# EAGLE design sa818shield (EAGLE 7.4.0)
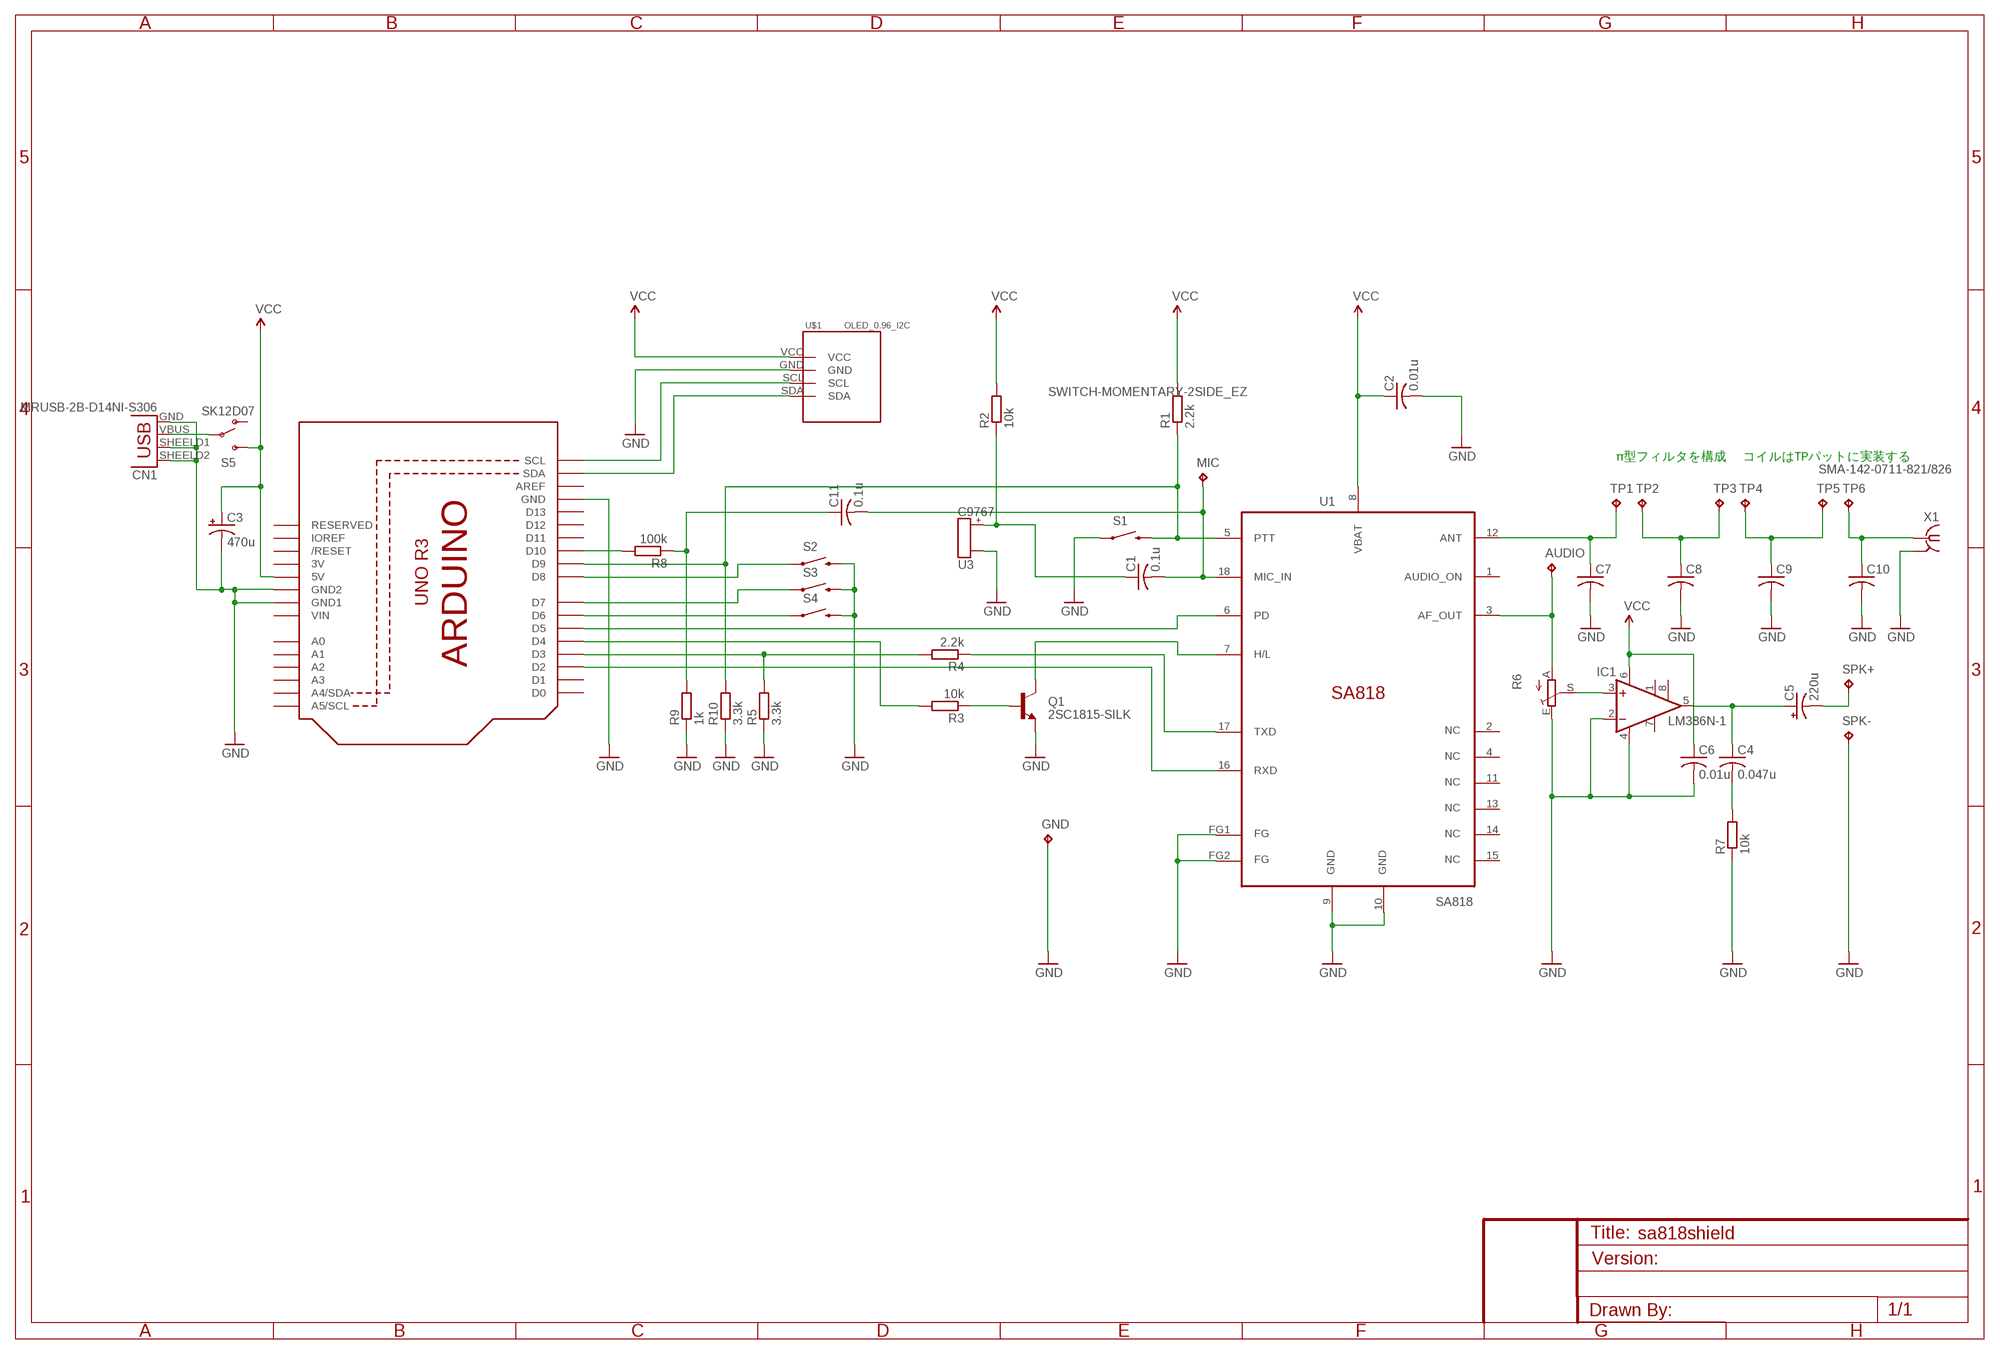
[diagram p0: schematic, sheet 1]

## Parts
AUDIO  TPPAD1-13  [P1-13]
C1  0.1u  C-US025-024X044  [C025-024X044]
C2  0.01u  C-US025-024X044  [C025-024X044]
C3  470u  CPOL-USE5-10.5  [E5-10,5]
C4  0.047u  C-US025-024X044  [C025-024X044]
C5  220u  CAP_POLPTH2  [CPOL-RADIAL-10UF-25V]
C6  0.01u  C-US025-024X044  [C025-024X044]
C7  C-USC0805K  [C0805K]
C8  C-USC0805K  [C0805K]
C9  C-USC0805K  [C0805K]
C10  C-USC0805K  [C0805K]
C11  0.1u  C-US025-024X044  [C025-024X044]
CN1  MRUSB-2B-D14NI-S306  [MRUSB-2B-D14NI-S306]
GND  TPPAD1-13  [P1-13]
IC1  LM386N-1  [DIL08]
MIC  TPPAD1-13  [P1-13]
Q1  2SC1815-SILK  [TO92-ECB]
R1  2.2k  R-EU_0204/5  [0204/5]
R2  10k  R-EU_0204/5  [0204/5]
R3  10k  R-EU_0204/5  [0204/5]
R4  2.2k  R-EU_0204/5  [0204/5]
R5  3.3k  R-EU_0204/5  [0204/5]
R6  TRIM_EU-S63S  [S63S]
R7  10k  R-EU_0204/5  [0204/5]
R8  100k  R-EU_0204/5  [0204/5]
R9  1k  R-EU_0204/5  [0204/5]
R10  3.3k  R-EU_0204/5  [0204/5]
S1  SWITCH-MOMENTARY-2SIDE_EZ  [TACTILE-PTH-SIDEEZ]
S2  SWITCH-MOMENTARY-2SIDE_EZ  [TACTILE-PTH-SIDEEZ]
S3  SWITCH-MOMENTARY-2SIDE_EZ  [TACTILE-PTH-SIDEEZ]
S4  SWITCH-MOMENTARY-2SIDE_EZ  [TACTILE-PTH-SIDEEZ]
S5  SK12D07  [SK12D07]
SPK+  TPPAD1-13  [P1-13]
SPK-  TPPAD1-13  [P1-13]
TP1  TPTP20SQ  [TP20SQ]
TP2  TPTP20SQ  [TP20SQ]
TP3  TPTP20SQ  [TP20SQ]
TP4  TPTP20SQ  [TP20SQ]
TP5  TPTP20SQ  [TP20SQ]
TP6  TPTP20SQ  [TP20SQ]
U1  SA818  [SA818]
U2  ARDUINOR3-DIMENSION  [ARDUINOR3]
U3  C9767  [C9767]
U$1  OLED_0.96_I2C  [OLED_0.96_I2C]
X1  SMA-142-0711-821/826  [J502-ND-142-0711-821/826]

## Nets
GND [power]: C2.2 C3.- C6.2 C7.2 C8.2 C9.2 C10.2 CN1.GND CN1.SHEELD1 CN1.SHEELD2 GND.TP IC1.2(-IN) IC1.4(GND) Q1.E R5.1 R6.E R7.1 R9.1 R10.1 S1.1 S2.2 S3.2 S4.2 SPK-.TP U1.9(GND) U1.10(GND) U1.FG1(FG) U1.FG2(FG) U2.GND U2.GND1 U2.GND2 U3.- U$1.GND X1.G@1 X1.G@2 X1.G@3 X1.G@4
N$1 [RF]: C9.1 TP4.TP TP5.TP
N$2: U2.SCL U$1.SCL
N$3: U2.SDA U$1.SDA
N$4 [RF]: CN1.VBUS S5.2(P)
N$5: R1.1 R10.2 U2.D9
N$6: C1.1 R2.1 U3.+
N$7: S4.1 U2.D6
N$8: U1.16(RXD) U2.D2
N$9: R4.1 U1.17(TXD)
N$10: R3.2 U2.D4
N$11: U1.6(PD) U2.D5
N$12: C1.2 C11.2 MIC.TP U1.18(MIC_IN)
N$13: S3.1 U2.D7
N$14: S2.1 U2.D8
N$15: IC1.3(+IN) R6.S
N$16: C5.2(-) SPK+.TP
N$17: AUDIO.TP R6.A U1.3(AF_OUT)
N$18: C4.1 C5.1(+) IC1.5(OUT)
N$19: C4.2 R7.2
N$20: R8.2 U2.D10
N$21 [RF]: C7.1 TP1.TP U1.12(ANT)
N$22: S1.2 U1.5(PTT)
N$23 [RF]: C8.1 TP2.TP TP3.TP
N$24 [RF]: C10.1 TP6.TP X1.1
N$25: Q1.B R3.1
N$26: Q1.C U1.7(H/L)
N$27: R4.2 R5.2 U2.D3
N$28: C11.1 R8.1 R9.2
VCC [power]: C2.1 C3.+ C6.1 IC1.6(VS) R1.2 R2.2 S5.3(S) U1.8(VBAT) U2.5V U$1.VCC
Unconnected: IC1.1(GAIN) IC1.7(BYPASS) IC1.8(GAIN) S5.1(O) U1.1(AUDIO_ON) U1.2(NC) U1.4(NC) U1.11(NC) U1.13(NC) U1.14(NC) U1.15(NC) U2.A0 U2.A1 U2.A2 U2.A3 U2.A4(A4/SDA) U2.A5(A5/SCL) U2.AREF U2.D0 U2.D1 U2.D11 U2.D12 U2.D13 U2.IOREF U2.RESERVED U2.RESET(/RESET)

## Notes on the sheet
- π型フィルタを構成 　コイルはTPパットに実装する

## Power pins joined to a net without a drawn wire
3V: U2.3V
VIN: U2.VIN

## Library data of the parts
AUDIO GND MIC SPK+ SPK- TP1-TP6 = testpad:TP: Test pad
C1 C2 C4 C6-C11 = adafruit:C-US: CAPACITOR, American symbol
C3 = adafruit:CPOL-US: POLARIZED CAPACITOR, American symbol
C5 = SparkFun-Capacitors:CAP_POL: Capacitor Polarized These are standard SMD and PTH capacitors. Normally 10uF, 47uF, and 100uF in electrolytic and tantalum varieties. Always verify the external diameter of the through hole cap, it varies with capacity, voltage, and manufacturer. The EIA devices should be standard.
CN1 = USB-4AF103BS:MRUSB-2B-D14NI-S306
IC1 = linear:LM386?-*: Low Voltage Audio Power Amplifier Source: http://cache.national.com/ds/LM/LM386.pdf
Q1 = BS21Lab-Transistors:2SC1815: NPN EPITAXIAL TRANSISTOR Source: TOSHIBA .. 2SC1815 1.pdf
R1-R5 R7-R10 = rcl:R-EU_: RESISTOR, European symbol
R6 = pot:TRIM_EU-: POTENTIOMETER
S1-S4 = SparkFun-Electromechanical:SWITCH-MOMENTARY-2: Various NO switches- pushbuttons, reed, etc
S5 = SK12D07:SK12D07
U1 = SA818:SA818: SA818 is a cost-effective integrate professional walkie talkie module, it comes with built-in high performance microcontroller, narrow band RF transceiver IC and RF power amplifier,SA818 offer standard UART interface, which easy to configure the related parameters and control the TX/RX function, Users only need to add external audio amplifier, microphone and speaker, then it becomes a professional walkie talkie, Simplified interface and Ultra small size make this module widely used in various applications and conveniently embedded into various handheld.
U2 = adafruit:ARDUINOR3: This is a new object for the new Arduino R3 - with extra pins that you may want to use (such as IOref, and duplicated A4/A5
U3 = akizuki:C9767: C9767 <http://akizukidenshi.com/catalog/g/gP-01810/> Electret Condenser Microphone
U$1 = tft_1.8_1.44_oled_0.96:OLED_0.96_I2C
X1 = con-coax:SMA-: SMA 50 Ohm End Launch Jack Receptacle - Round Contact Johnson Components Source: www.johnsoncomponents.com .. J502-ND.pdf; MF: JOHNSON COMPONENTS; MPN: 142-0711-821; OC_FARNELL: 1019328; OC_NEWARK: 16F3627

## Net classes
1 power: width 0.914 mm, drill 0.254 mm
2 RF: width 0.61 mm, drill 0.203 mm, clearance 0.508 mm

## Board
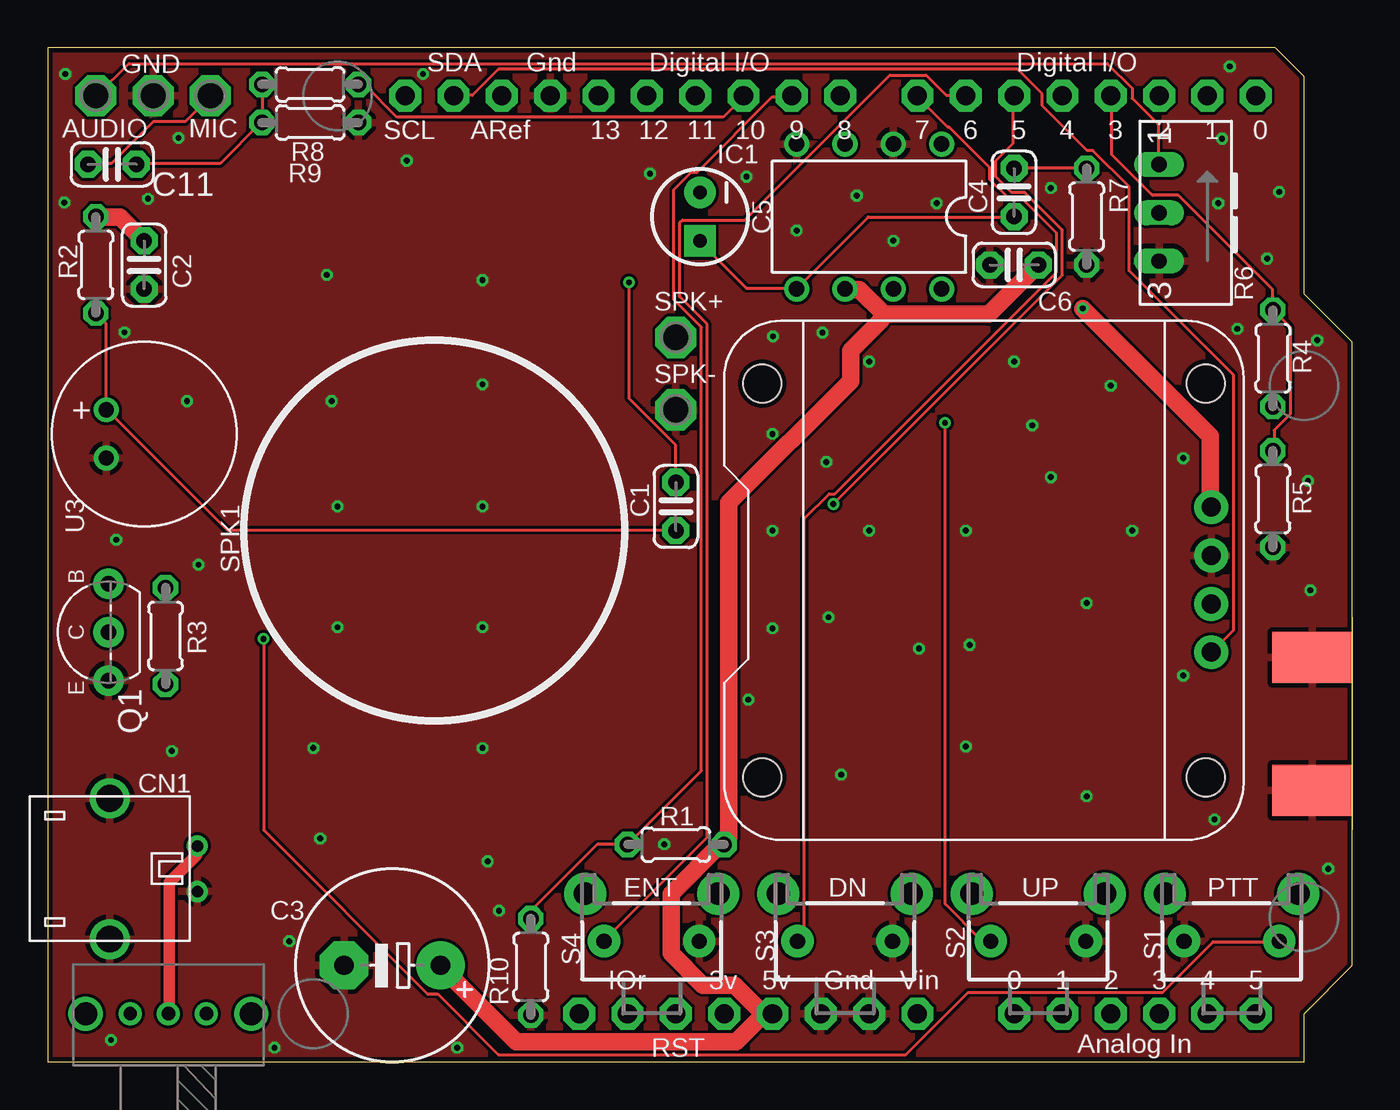
[diagram p1: board, top side]
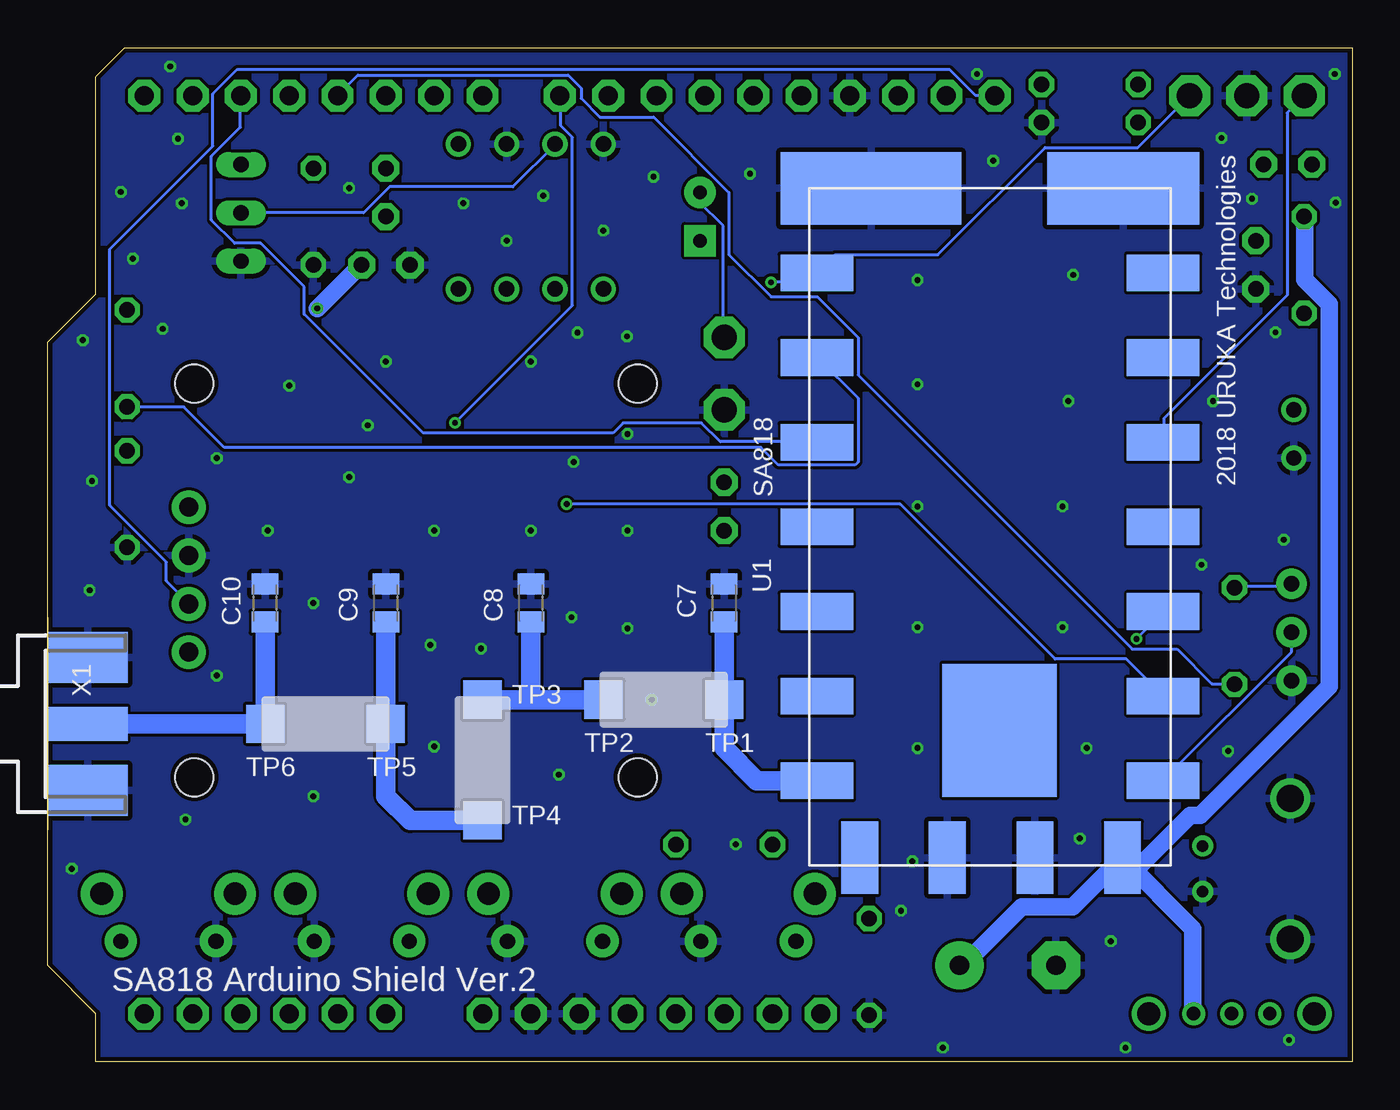
[diagram p2: board, bottom side, seen from below]

Size 68.58 x 53.34 mm. Coordinates in mm from the lower left corner, seen from the top.
Copper layers (1*16): Top 0.035mm / dielectric 1.5mm / Bottom 0.035mm
Design rules "ssci_SeeedStudio_2layer_DRU_no_angle": minimum track width 6mil, minimum drill 12mil, track to track 6mil, track to pad 6mil, pad to pad 6mil, via to via 6mil, smd to smd 0mil, copper to edge 10mil, drill to drill 10mil, minimum pad ring 10mil, minimum via ring 6mil, stop-mask expansion 2mil, vias tented up to drill 25mil, thermal gap 10mil

### Footprints (pad centres in the part's own frame; a part is rotated, then mirrored left to right if it is on the bottom)
P1-13 = drill 1.321 pad 2.159 octagon: TP 0,0
C025-024X044 = drill 0.813 pad 1.422 octagon: 1 -1.27,0; 2 1.27,0
E5-10,5 = drill 1.016 pad 2.54: + -2.54,0 | drill 1.016 pad 2.54 octagon: - 2.54,0
CPOL-RADIAL-10UF-25V = drill 0.7 pad 1.651 square: 1 1.27,0 | drill 0.7 pad 1.651: 2 -1.27,0
C0805K = smd 1.1 x 1.4: 1 -1,0; 2 1,0
MRUSB-2B-D14NI-S306 = drill 0.6: GND 6.6,-1.2; VBUS 6.6,1.2 | drill 1.4: SHEELD1 2,-3.7; SHEELD2 2,3.7
DIL08 = drill 0.813 pad 1.27: 1 -3.81,-3.81; 2 -1.27,-3.81; 3 1.27,-3.81; 4 3.81,-3.81; 5 3.81,3.81; 6 1.27,3.81; 7 -1.27,3.81; 8 -3.81,3.81
TO92-ECB = drill 0.813 pad 1.6: B 2.54,0; C 0,0; E -2.54,0
0204/5 = drill 0.813 octagon: 1 -2.54,0; 2 2.54,0
S63S = drill 0.813 long: A 2.54,1.27; E -2.54,1.27; S 0,1.27
TACTILE-PTH-SIDEEZ = drill 0.8 pad 1.7: 1 -2.5,0; 2 2.5,0 | drill 1.2 pad 2.2: ANCHOR1 -3.5,2.5; ANCHOR2 3.5,2.5
SK12D07 = drill 0.7: 1 0,2; 2 0,0; 3 0,-2 | drill 1.2: SHIELD1 0,4.35; SHIELD2 0,-4.35
TP20SQ = smd 2 x 2: TP 0,0
SA818 = smd 7 x 6: 0 10.5,0.5 | smd 1.93 x 3.81: 1 -13.55,9.1; 2 -9.1,9.1; 3 -4.65,9.1; 4 -0.2,9.1; 5 4.25,9.1; 6 8.7,9.1; 7 13.15,9.1; 12 13.15,-9.1; 13 8.7,-9.1; 14 4.25,-9.1; 15 -0.2,-9.1; 16 -4.65,-9.1; 17 -9.1,-9.1; 18 -13.55,-9.1 | smd 3.81 x 1.93: 8 17.2,6.96; 9 17.2,2.36; 10 17.2,-2.24; 11 17.2,-6.84 | smd 3.81 x 8: FG1 -18,7 | smd 3.81 x 9.5: FG2 -18,-6.25
ARDUINOR3 = drill 1 pad 1.676 octagon: 3V 35.56,2.54; 5V 38.1,2.54; A0 50.8,2.54; A1 53.34,2.54; A2 55.88,2.54; A3 58.42,2.54; A4 60.96,2.54; A5 63.5,2.54; AREF 23.876,50.8; D0 63.5,50.8; D1 60.96,50.8; D2 58.42,50.8; D3 55.88,50.8; D4 53.34,50.8; D5 50.8,50.8; D6 48.26,50.8; D7 45.72,50.8; D8 41.656,50.8; D9 39.116,50.8; D10 36.576,50.8; D11 34.036,50.8; D12 31.496,50.8; D13 28.956,50.8; GND 26.416,50.8; GND1 43.18,2.54; GND2 40.64,2.54; IOREF 30.48,2.54; RESERVED 27.94,2.54; RESET 33.02,2.54; SCL 18.796,50.8; SDA 21.336,50.8; VIN 45.72,2.54
C9767 = drill 0.8: + -2,1.27; - -2,-1.27
OLED_0.96_I2C = drill 1 pad 1.778: GND -1.63,11.63; SCL 0.91,11.63; SDA 3.45,11.63; VCC -4.17,11.63 | hole 2: -10.67,-11.97; 10.03,-11.97; 10.03,11.33; -10.67,11.33
J502-ND-142-0711-821/826 = smd 4.191 x 1.778: 1 2.115,0 | smd 4.191 x 2.667: G@1 2.115,3.495; G@2 2.115,-3.495 | smd 4.191 x 2.667 bottom: G@3 2.115,3.495; G@4 2.115,-3.495

### Placement (x,y rotation side)
AUDIO  2.54,50.8 0 top
C1  33.02,29.21 90 top
C2  5.08,41.91 270 top
C3  18.12,5.08 180 top
C4  50.8,45.72 90 top
C5  34.29,44.45 270 top
C6  50.8,41.91 180 top
C7  33.02,24.13 90 bottom
C8  43.18,24.13 90 bottom
C9  50.8,24.13 90 bottom
C10  57.15,24.13 90 bottom
C11  3.4,47.2 180 top
CN1  1.27,10.16 0 top
GND  5.55,50.8 0 top
IC1  43.18,44.45 180 top
MIC  8.56,50.8 0 top
Q1  3.2,22.6 90 top
R1  33.02,11.43 0 top
R2  2.54,41.91 90 top
R3  6.2,22.4 270 top
R4  64.4,37 90 top
R5  64.4,29.6 90 top
R6  59.69,44.65 90 top
R7  54.61,44.45 90 top
R8  13.8,51.4 0 top
R9  13.8,49.4 180 top
R10  25.4,5 90 top
S1  62.23,6.35 0 top
S2  52.07,6.35 0 top
S3  41.91,6.35 0 top
S4  31.75,6.35 0 top
S5  6.35,2.54 90 top
SPK+  33.02,38.1 0 top
SPK-  33.02,34.29 0 top
TP1  33.02,19.05 0 bottom
TP2  39.37,19.05 0 bottom
TP3  45.72,19.05 0 bottom
TP4  45.72,12.7 0 bottom
TP5  50.8,17.78 0 bottom
TP6  57.15,17.78 0 bottom
U1  19.05,27.94 270 bottom
U2  0,0 0 top
U3  5.08,33.02 0 top
U$1  49.53,25 270 top
X1  68.58,17.78 0 bottom

### Tracks (layer width: path | path; a pad name or v marks a point on that pad's centre or on a via)
GND  (via drill 0.3)
  other vias: 3.61,27.46 38.1,33.02 38.1,22.8 64.1,42.24 66.24,30.55 66.37,24.8 12.7,6.35 4.04,38.37 22.86,29.21 22.86,16.51 52.73,30.75 41.71,15.11 6.88,48.59 22.86,41.11 15.24,22.86 13.97,16.51 54.61,13.97 54.61,24.13 55.88,35.56 43.18,36.83 67.31,10.16 39.37,43.72 44.45,43.18 22.86,22.86 22.86,35.63 15.24,29.21 57.01,27.94 45.8,21.74 48.26,27.94 43.18,27.94 38.1,27.94 48.46,21.93 48.26,16.59 51.75,33.48 59.69,31.75 59.69,20.32 32.41,11.45 41.04,23.39 36.83,19.05 50.8,36.83 40.93,31.55 40.73,38.35 38.13,38.15 14.93,34.75 7.93,26.15 7.33,34.75 64.73,45.75 42.53,45.55 23.73,7.95 14.33,11.75 23.13,10.55 21.53,0.75 3.33,1.15 11.93,0.75 6.53,16.35 0.93,51.95 19.73,51.95 5.28,45.39 18.88,47.39 14.68,41.39 0.88,45.19 31.66,46.71 62.13,52.35 61.53,45.15 61.73,48.55 52.73,45.95 46.73,45.15 36.73,46.55 62.53,38.55 66.73,37.95 61.33,12.75
  pour Top: 0,0 68.58,0 68.58,53.34 0,53.34
  pour Bottom: 0,0 68.58,0 68.58,53.34 0,53.34
N$1
  Bottom 1.016: TP4.TP 49.53,12.7 50.8,13.97 TP5.TP C9.1
N$2
  Bottom 0.152: U2.SCL 18.82,50.83 19.81,50.83 21.18,52.2 58.6,52.2 59.89,50.9 59.89,48.16 65.3,42.75 65.3,29.26 62.33,26.29 62.33,25.3 61.19,24.16 U$1.SCL
N$3
  Top 0.152: U2.SDA 21.34,50.83 22.33,50.83 23.7,52.2 50.98,52.2 52.27,50.9 52.27,50.29 54.63,47.93 54.94,47.93 56.84,46.02 56.84,41.6 62.33,36.12 62.33,22.71 61.19,21.57 U$1.SDA
N$4
  Top 0.61: CN1.VBUS 7.85,11.35 7.85,10.9 6.4,9.45 6.4,2.59 S5.2
N$5
  Top 0.152: R10.2 25.45,7.54 25.45,8 28.88,11.43 R1.1 34.37,15.32 34.37,38.63 32.92,40.08 32.92,45.87 33.83,46.79 34.14,46.79 38.1,50.75 39.09,50.75 U2.D9
N$6
  Top 0.152: R2.1 3.05,38.86 3.05,34.29 U3.+ 3.12,34.29 9.45,27.96 32.99,27.96 C1.1
N$7
  Top 0.152: U2.D6 48.23,50.83 47.24,50.83 46.18,51.89 44.27,51.89 36.65,44.27 33.38,44.27 33.22,44.12 33.22,40.23 34.67,38.79 34.67,11.81 29.26,6.4 S4.1
N$8
  Bottom 0.152: U2.D2 58.45,50.75 58.45,49.15 59.97,47.62 59.97,44.27 58.75,43.05 57.38,43.05 55.09,40.77 55.09,39.32 48.84,33.07 38.86,33.07 38.33,33.6 34.21,33.6 33.22,32.61 28.19,32.61 U1.16
N$9
  Bottom 0.152: R4.1 64.39,34.44 61.42,34.44 59.28,32.31 31.09,32.31 30.18,31.39 26.14,31.39 25.98,31.55 25.98,34.9 28.12,37.03 U1.17
N$10
  Bottom 0.152: R3.2 6.25,19.89 7.39,19.89 9.22,21.72 11.58,21.72 25.98,36.12 25.98,38.1 28.12,40.23 30.56,40.23 32.77,42.44 32.77,45.72 36.73,49.68 39.55,49.68 40.54,50.67 40.54,51.21 41.22,51.89 52.27,51.89 53.34,50.83 U2.D4
N$11  (via drill 0.3)
  Top 0.152: v41.3,29.34 53.34,41.38 53.34,43.74 51.36,45.72 50.67,45.72 49.84,46.56 49.84,47.4 50.75,48.31 50.75,50.75 U2.D5
  Bottom 0.152: v41.3,29.34 23.77,29.34 15.62,21.18 11.89,21.18 9.98,19.28 U1.6
N$12  (via drill 0.3)
  Top 0.152: C11.2 2.13,47.24 3.35,47.24 5.56,49.45 7.24,49.45 8.53,50.75 MIC.TP | v30.56,41 30.56,34.9 32.99,32.46 32.99,30.48 C1.2
  Bottom 0.152: v30.56,41 28.65,41 28.19,41.45 U1.18 28.12,41.53 27.2,42.44 21.79,42.44 16.15,48.08 11.28,48.08 8.61,50.75 MIC.TP
N$13
  Top 0.152: U2.D7 45.72,50.75 47.32,49.15 47.4,49.15 49.53,47.02 49.53,46.41 50.52,45.41 51.21,45.41 53.03,43.59 53.03,41.53 41.38,29.87 41.07,29.87 39.78,28.57 39.78,6.71 39.47,6.4 S3.1
N$14  (via drill 0.3)
  Top 0.152: v47.17,33.6 47.17,8.31 49.07,6.4 49.53,6.4 S2.1
  Bottom 0.152: v47.17,33.6 41,39.78 41,48.62 41.6,49.23 41.6,50.75 U2.D8
N$15
  Bottom 0.152: R6.S 58.37,44.65 51.97,44.65 50.6,46.02 44.12,46.02 41.91,48.23 IC1.3
N$16
  Bottom 0.152: C5.2 34.29,45.19 33.07,43.97 33.07,38.1 SPK+.TP
N$17
  Top 0.152: R6.A 58.37,47.24 58.37,49.3 57,50.67 57,51.21 55.7,52.5 4.27,52.5 2.59,50.83 AUDIO.TP
  Bottom 0.152: AUDIO.TP 3.43,49.91 3.43,40.31 9.91,33.83 9.91,32.61 U1.3
N$18
  Top 0.152: C5.1 34.29,43.13 36.73,40.69 39.32,40.69 IC1.5 39.4,40.69 43.13,44.42 50.75,44.42 C4.1
N$19
  Top 0.152: R7.2 54.56,47.02 50.83,47.02 C4.2
N$20
  Top 0.152: R8.2 16.38,51.36 16.69,51.36 18.36,49.68 35.51,49.68 36.58,50.75 U2.D10
N$21
  Bottom 0.61: C7.1 33.07,23.16 33.02,22.86
  Bottom 1.016: U1.12 31.3,14.79 33.02,16.51 TP1.TP 33.02,22.86
N$22  (via drill 0.3)
  Top 0.152: v11.35,22.25 11.35,12.19 19.96,3.58 20.5,3.58 23.7,0.38 45.11,0.38 48.39,3.66 58.6,3.66 61.27,6.33 64.69,6.33 S1.2
  Bottom 0.152: v11.35,22.25 9.98,23.62 U1.5
N$23
  Bottom 1.016: TP2.TP 43.18,19.05 | 43.18,19.05 TP3.TP | C8.1 43.18,19.05
N$24
  Bottom 1.016: X1.1 TP6.TP C10.1
N$25
  Bottom 0.152: R3.1 6.17,24.99 3.28,24.99 3.2,25.07 Q1.B
N$26
  Bottom 0.152: Q1.C 3.2,22.55 3.2,21.57 9.91,14.86 U1.7
N$27
  Top 0.152: R5.2 64.47,32.16 64.47,33.22 65.3,34.06 65.3,38.63 64.47,39.47 R4.2 64.39,39.55 64.39,40.62 59.44,45.57 58.06,45.57 55.93,47.7 55.93,50.75 U2.D3
N$28
  Top 0.152: R8.1 11.28,51.36 11.28,49.45 R9.2 11.2,49.38 9.07,47.24 4.72,47.24 C11.1
VCC  (via drill 0.3)
  Top 0.914: C3.+ 20.66,5.03 24.62,1.07 36.2,1.07 37.64,2.52 38.1,2.52 U2.5V 37.34,2.82 36.12,4.04 34.44,4.04 32.77,5.71 32.77,8.84 35.36,11.43 R1.2 35.81,11.81 35.81,29.41 42.22,35.81 42.22,37.41 43.74,38.94 43.97,39.32 | R2.2 2.59,44.42 3.81,44.42 5.03,43.2 C2.1 | 43.97,39.32 42.67,40.62 41.91,40.62 IC1.6 | 43.97,39.32 49.45,39.32 52.05,41.91 C6.1 | v54.41,39.62 61.11,32.92 61.11,29.64 U$1.VCC
  Bottom 0.914: S5.3 8.38,2.59 8.38,7.01 12.04,10.67 U1.8 | R2.2 2.52,44.42 2.52,41.15 1.22,39.85 1.22,19.74 8,12.95 8.53,12.95 11.12,10.36 U1.8 | C3.+ 20.66,5.11 20.42,5.11 17.37,8.15 14.71,8.15 12.42,10.44 U1.8 | v54.41,39.62 52.12,41.91 C6.1

### Text on the board
tPlace: SPK1 | ENT | DN | UP | PTT
bNames: 2018 URUKA Technologies | SA818 Arduino Shield Ver.2